# EAGLE design SolarCharger_Rev1 (EAGLE 7.4.0)
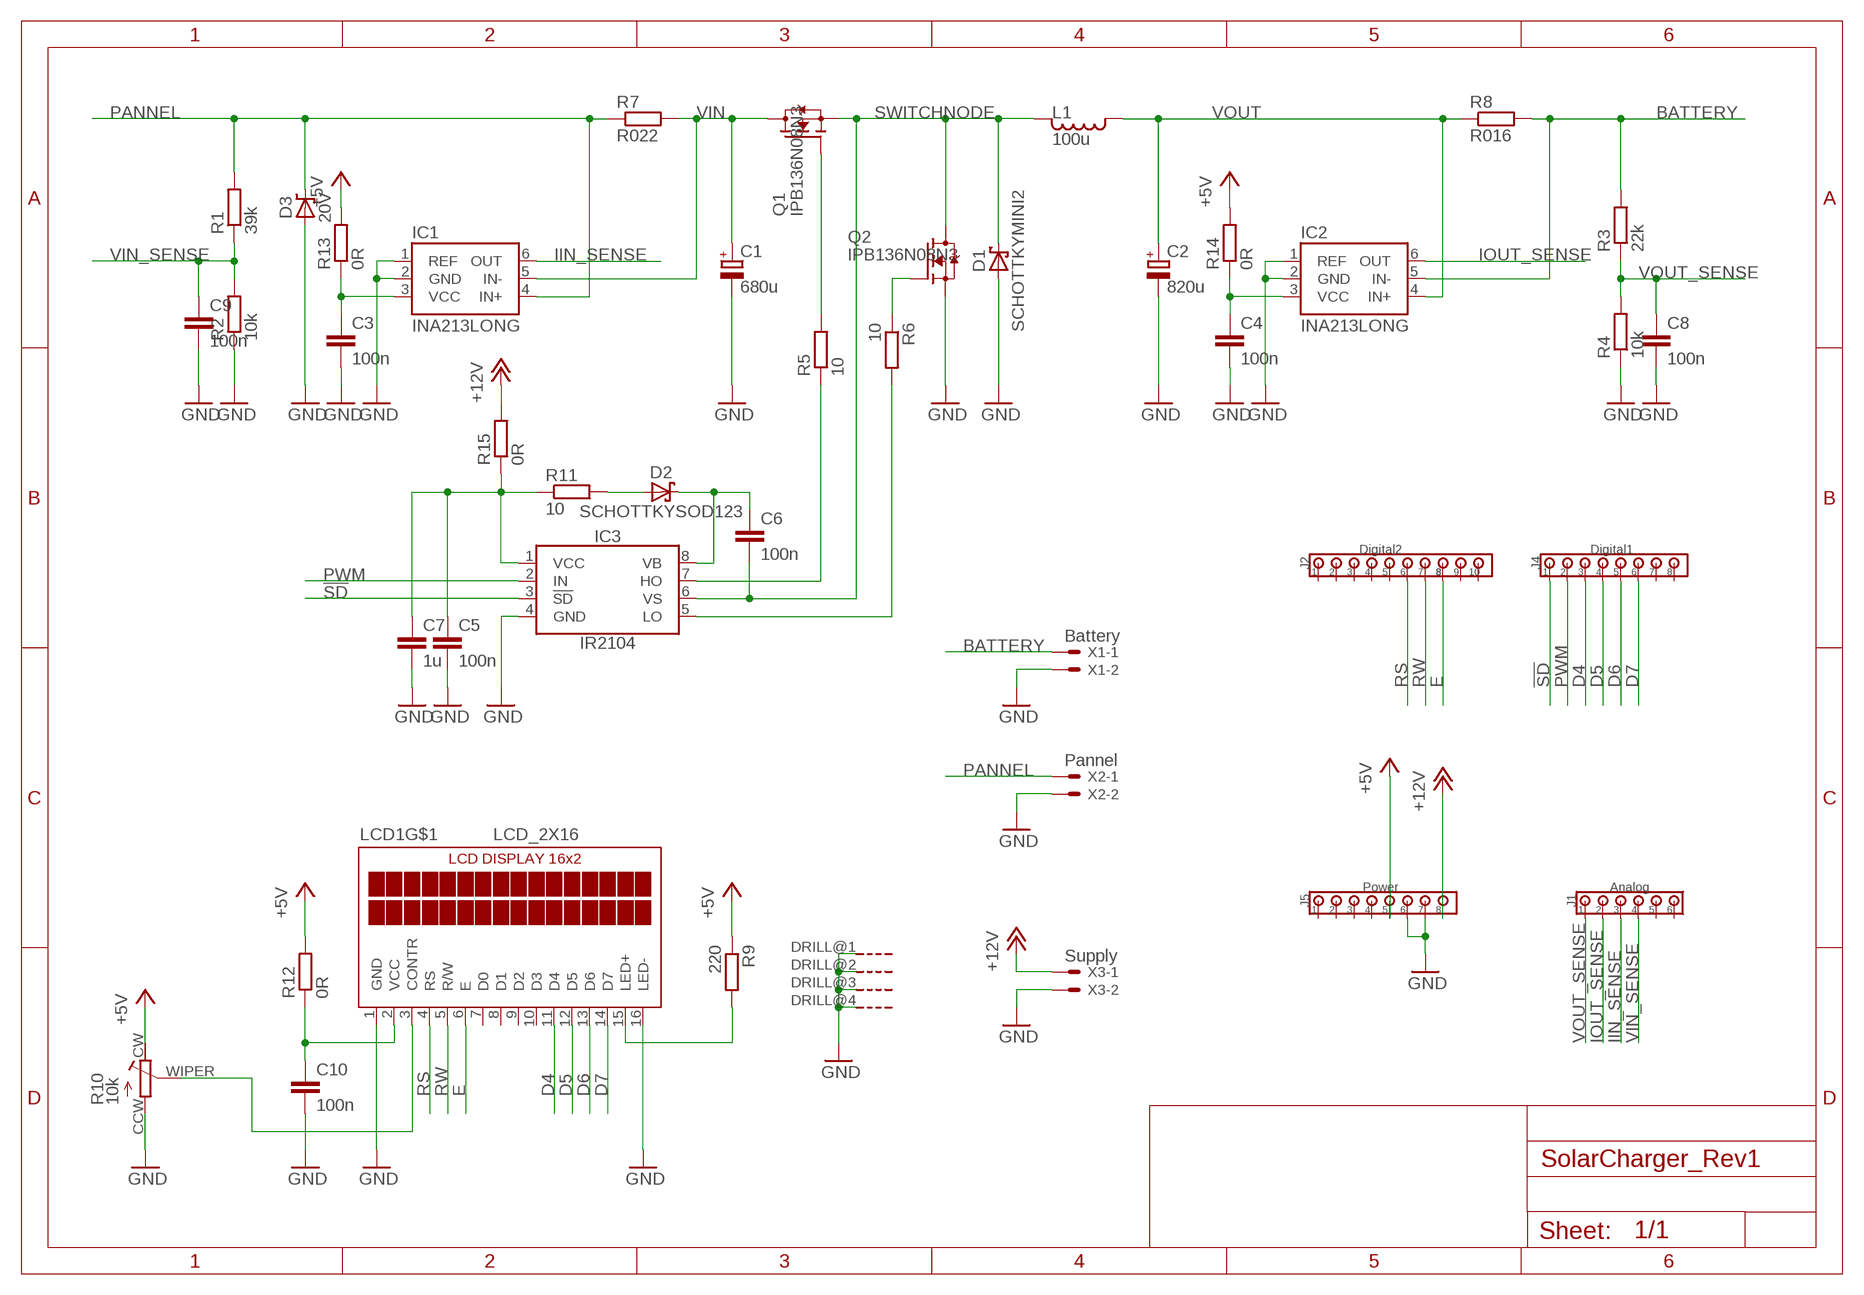
[diagram p0: schematic, sheet 1]

## Parts
C1  680u  C_POLARIZED10MM  [10MM]
C2  820u  C_POLARIZED10MM  [10MM]
C3  100n  CC0805  [C0805]
C4  100n  CC0805  [C0805]
C5  100n  CC0805  [C0805]
C6  100n  CC0805  [C0805]
C7  1u  CC0805  [C0805]
C8  100n  CC0805  [C0805]
C9  100n  CC0805  [C0805]
C10  100n  CC0805  [C0805]
D1  SCHOTTKYMINI2  [MINI2-F3-B]
D2  SCHOTTKYSOD123  [SOD123]
D3  20V  ZENERSMC  [SMC]
IC1  INA213LONG  [SC70-6_LONG]
IC2  INA213LONG  [SC70-6_LONG]
IC3  IR2104  [SOIC8]
J1  Analog  100MIL_6X  [100MIL_6X_ROUND]
J2  Digital2  100MIL_10X  [100MIL_10X_ROUND]
J4  Digital1  100MIL_8X  [100MIL_8X_ROUND]
J5  Power  100MIL_8X  [100MIL_8X_ROUND]
L1  100u  INDUCTORMSS1583  [MSS1583]
LCD1  LCD_2X16  [LCD_2X16]
Q1  IPB136N08N3  N-PWR-MOSFETTO263-3  [TO263-3]
Q2  IPB136N08N3  IPB136N08N3_GTO263  [TO263-3@1]
R1  39k  RESISTORR0805  [R0805]
R2  10k  RESISTORR0805  [R0805]
R3  22k  RESISTORR0805  [R0805]
R4  10k  RESISTORR0805  [R0805]
R5  10  RESISTORR0805  [R0805]
R6  10  RESISTORR0805  [R0805]
R7  R022  RESISTOR0612  [0612]
R8  R016  RESISTOR0612  [0612]
R9  220  RESISTORR0805  [R0805]
R10  10k  TRIMMER3314G  [RTRIM3314G]
R11  10  RESISTORR0805  [R0805]
R12  0R  RESISTORR0805  [R0805]
R13  0R  RESISTORR0805  [R0805]
R14  0R  RESISTORR0805  [R0805]
R15  0R  RESISTORR0805  [R0805]
X1  Battery  22-23-2021200MIL  [200MIL_2X]
X2  Pannel  22-23-2021200MIL  [200MIL_2X]
X3  Supply  22-23-2021100MIL  [22-23-2021]

## Nets
!SD!: IC3.3(!SD!) J4.1
+5V: J5.5 R9.1 R10.CW R12.2 R13.2 R14.2
+12V: J5.8 R15.2 X3.1
BATTERY: IC2.5(IN-) R3.2 R8.2 X1.1
D4: J4.3 LCD1.11(D4)
D5: J4.4 LCD1.12(D5)
D6: J4.5 LCD1.13(D6)
D7: J4.6 LCD1.14(D7)
E: J2.8 LCD1.6(E)
GND: C1.- C2.- C3.2 C4.2 C5.2 C7.2 C8.2 C9.2 C10.2 D1.A D3.A IC1.1(REF) IC1.2(GND) IC2.1(REF) IC2.2(GND) IC3.4(GND) J5.6 J5.7 LCD1.1(GND) LCD1.16(LED-) LCD1.DRILL@1(G) LCD1.DRILL@2(G) LCD1.DRILL@3(G) LCD1.DRILL@4(G) Q2.3(S) R2.1 R4.1 R10.CCW X1.2 X2.2 X3.2
IIN_SENSE: IC1.6(OUT) J1.3
IOUT_SENSE: IC2.6(OUT) J1.2
N$1: C10.1 LCD1.2(VCC) R12.1
N$2: C3.1 IC1.3(VCC) R13.1
N$3: C4.1 IC2.3(VCC) R14.1
N$4: Q1.1(G) R5.2
N$5: C5.1 C7.1 IC3.1(VCC) R11.1 R15.1
N$7: Q2.1(G) R6.1
N$9: LCD1.15(LED+) R9.2
N$10: LCD1.3(CONTR) R10.WIPER
N$11: D2.A R11.2
N$12: C6.1 D2.C IC3.8(VB)
N$14: IC3.7(HO) R5.1
N$15: IC3.5(LO) R6.2
PANNEL: D3.C IC1.4(IN+) R1.2 R7.1 X2.1
PWM: IC3.2(IN) J4.2
RS: J2.6 LCD1.4(RS)
RW: J2.7 LCD1.5(R/W)
SWITCHNODE: C6.2 D1.C IC3.6(VS) L1.2 Q1.3(S) Q2.TAB(D)
VIN: C1.+ IC1.5(IN-) Q1.TAB(D) R7.2
VIN_SENSE: C9.1 J1.4 R1.1 R2.2
VOUT: C2.+ IC2.4(IN+) L1.1 R8.1
VOUT_SENSE: C8.1 J1.1 R3.1 R4.2
Unconnected: J1.5 J1.6 J2.1 J2.2 J2.3 J2.4 J2.5 J2.9 J2.10 J4.7 J4.8 J5.1 J5.2 J5.3 J5.4 LCD1.7(D0) LCD1.8(D1) LCD1.9(D2) LCD1.10(D3)

## Library data of the parts
C1 C2 = 00Capacitor:C_POLARIZED
C3-C10 = 00Capacitor:C: Capacitor
D1 D2 = 00Diode:SCHOTTKY
D3 = 00Diode:ZENER
IC1 IC2 = 00Sensor:INA21*: Current-Shunt Monitors Voltage Output, Low- or High-Side Measurement, Bidirectional, Zero-Drift Series; GAIN: 50
IC3 = 00Logic:IR2104: Half-Bridge Driver Up to +600V Gate drive supply 10-20V Deadtime 520ns
J1 = 00Connector:100MIL_6X: 100 mil 6-pin connector
J2 = 00Connector:100MIL_10X: 100mil 10-pin connector
J4 J5 = 00Connector:100MIL_8X: 100 mil 8-pin connector
L1 = 00Inductor:INDUCTOR
LCD1 = 00Display:LCD_2X16
Q1 = 00Mosfet:N-PWR-MOSFET
Q2 = 00Mosfet:IPB136N08N3_G
R1-R9 R11-R15 = 00Resistor:RESISTOR: RESISTOR, European symbol
R10 = 00Resistor:TRIMMER
X1 X2 = 00Connector:22-23-2021: .100" (2.54mm) Center Header - 2 Pin
X3 = 00Connector:22-23-2021: .100" (2.54mm) Center Header - 2 Pin; MF: MOLEX; MPN: 22-23-2021; OC_FARNELL: 1462926; OC_NEWARK: 25C3832

## Board
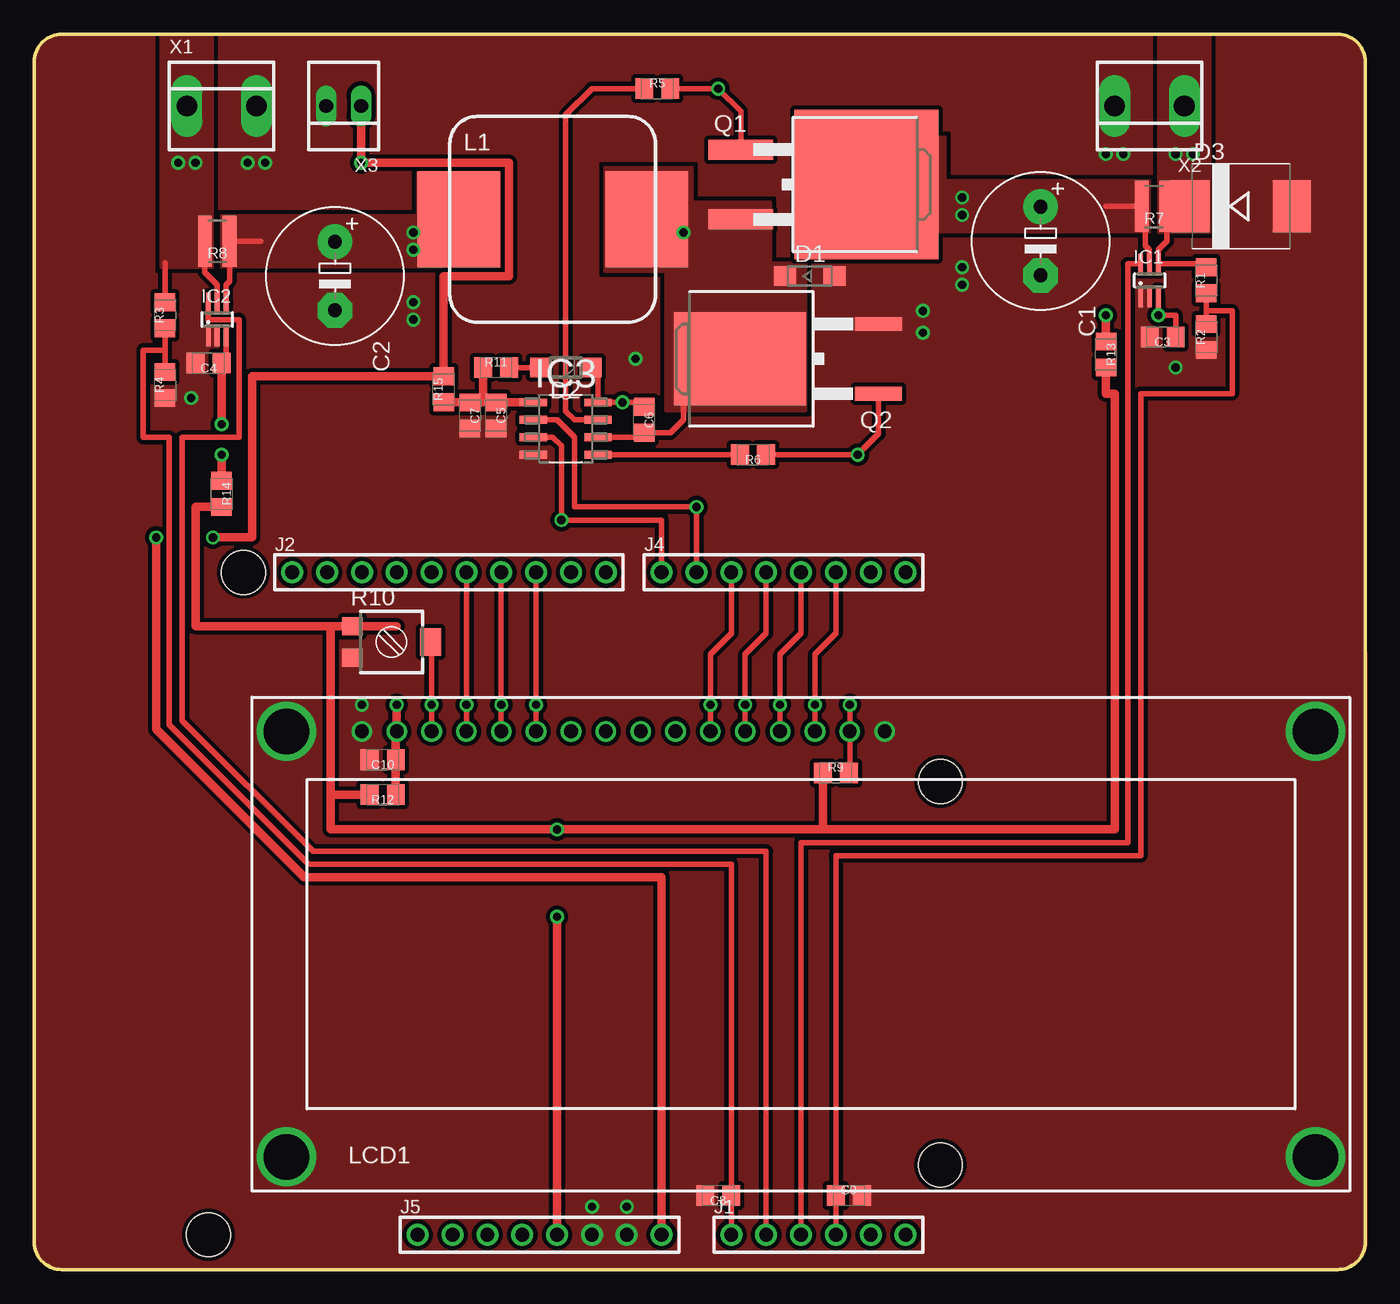
[diagram p1: board, top side]
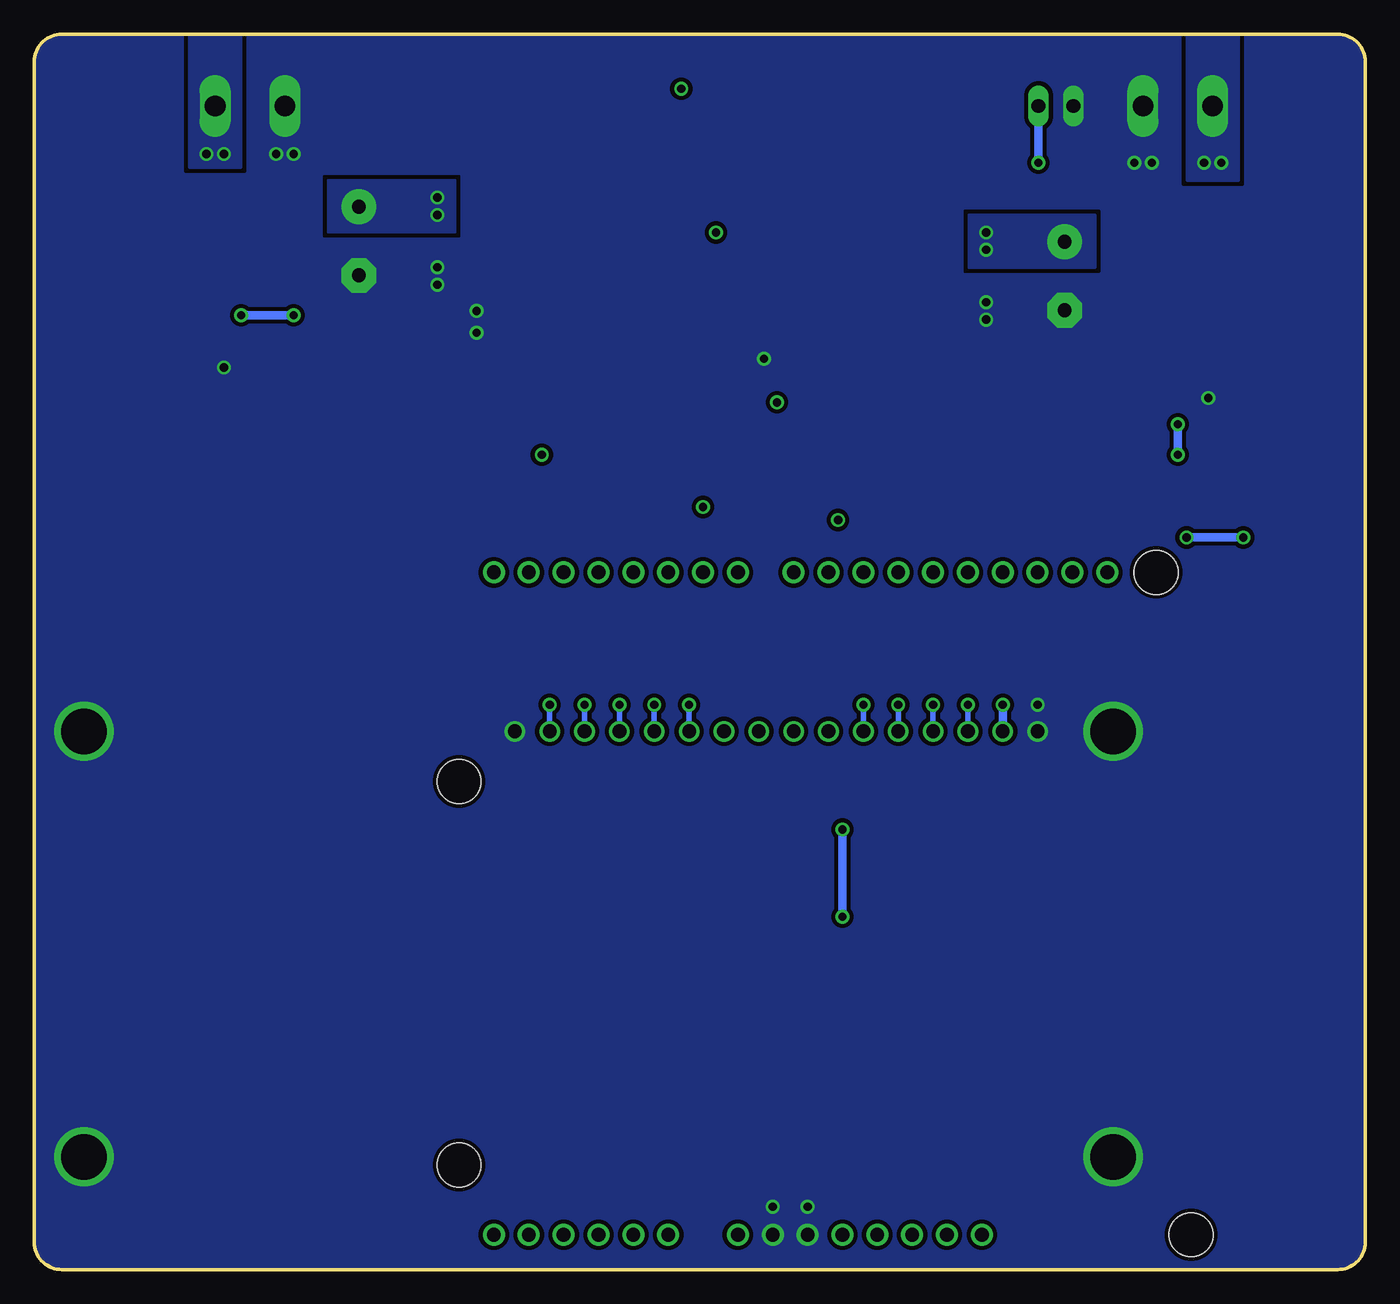
[diagram p2: board, bottom side, seen from below]

Size 97 x 90 mm. Coordinates in mm from the lower left corner, seen from the top.
Outline: 65.04,0 95,0 arc90 97,2 97,88 arc90 95,90 2,90 arc90 0,88 0,2 arc90 2,0 65.02,0
Outline: 65.02,0 arc-90 65.04,0
Outline: 65.04,0 65.02,0
Copper layers (1*16): Top 0.035mm / dielectric 1.5mm / Bottom 0.035mm
Design rules "default *": minimum track width 10mil, minimum drill 24mil, track to track 8mil, track to pad 8mil, pad to pad 8mil, via to via 8mil, smd to smd 8mil, copper to edge 0mil, drill to drill 8mil, minimum pad ring 10mil, minimum via ring 8mil, stop-mask expansion 4mil, vias tented up to drill 0mil, thermal gap 10mil
Holes 3.2 mm at 15.24,50.8 66.04,7.62 66.04,35.56 12.7,2.54

### Footprints (pad centres in the part's own frame; a part is rotated, then mirrored left to right if it is on the bottom)
10MM = drill 1.016 pad 2.54: + -2.5,0 | drill 1.016 pad 2.54 octagon: - 2.5,0
C0805 = smd 1.3 x 1.5: 1 -0.95,0; 2 0.95,0
MINI2-F3-B = smd 1.6 x 1.4: A 1.8,0; C -1.8,0
SOD123 = smd 1.4 x 1.4: A 1.9,0; C -1.9,0
SMC = smd 2.8 x 3.8: A 3.7,0; C -3.7,0
SC70-6_LONG = smd 0.35 x 1.5: 1 -0.65,-1.2; 2 0,-1.2; 3 0.65,-1.2; 4 0.65,1.2; 5 0,1.2; 6 -0.65,1.2
SOIC8 = smd 1.981 x 0.559: 1 -2.362,1.905; 2 -2.362,0.635; 3 -2.362,-0.635; 4 -2.362,-1.905; 5 2.362,-1.905; 6 2.362,-0.635; 7 2.362,0.635; 8 2.362,1.905
100MIL_6X_ROUND = drill 1 pad 1.6: 1 -6.35,0; 2 -3.81,0; 3 -1.27,0; 4 1.27,0; 5 3.81,0; 6 6.35,0
100MIL_10X_ROUND = drill 1 pad 1.6: 1 -8.89,0; 2 -6.35,0; 3 -3.81,0; 4 -1.27,0; 5 1.27,0; 6 3.81,0; 7 6.35,0; 8 8.89,0; 9 11.43,0; 10 13.97,0
100MIL_8X_ROUND = drill 1 pad 1.6: 1 -8.89,0; 2 -6.35,0; 3 -3.81,0; 4 -1.27,0; 5 1.27,0; 6 3.81,0; 7 6.35,0; 8 8.89,0
MSS1583 = smd 6 x 7: 1 -6.85,0; 2 6.85,0
LCD_2X16 = drill 1: 1 8,33.5; 2 10.54,33.5; 3 13.08,33.5; 4 15.62,33.5; 5 18.16,33.5; 6 20.7,33.5; 7 23.24,33.5; 8 25.78,33.5; 9 28.32,33.5; 10 30.86,33.5; 11 33.4,33.5; 12 35.94,33.5; 13 38.48,33.5; 14 41.02,33.5; 15 43.56,33.5; 16 46.1,33.5 | drill 3.3: DRILL@1 2.5,33.5; DRILL@2 77.5,33.5; DRILL@3 77.5,2.5; DRILL@4 2.5,2.5
TO263-3 = smd 1.45 x 4.7: 1 -2.54,-5.65; 3 2.54,-5.65 | smd 10.9 x 10.5: TAB 0,3.5
TO263-3@1 = smd 1 x 3.4: 1 -2.54,-6.6; 3 2.54,-6.6 | smd 6.8 x 9.6: TAB 0,3.5
R0805 = smd 1.3 x 1.5: 1 -0.95,0; 2 0.95,0
0612 = smd 1 x 3.7: 1 -0.9,0; 2 0.9,0
RTRIM3314G = smd 1.3 x 1.5: CCW 1.15,-2.85; CW -1.15,-2.85 | smd 2 x 1.5: WIPER 0,2.85
200MIL_2X = drill 1.5 long: 1 -2.54,0; 2 2.54,0
22-23-2021 = drill 1 long: 1 -1.27,0; 2 1.27,0

### Placement (x,y rotation side)
C1  73.34,74.93 270 top
C2  21.91,72.39 270 top
C3  82.23,67.94 180 top
C4  12.7,66.04 180 top
C5  33.66,62.23 270 top
C6  44.45,61.91 270 top
C7  31.75,62.23 270 top
C8  49.85,5.4 180 top
C9  59.37,5.4 0 top
C10  25.4,37.15 180 top
D1  56.52,72.39 0 top
D2  38.73,65.72 180 top
D3  87.95,77.47 0 top
IC1  81.28,72.07 0 top
IC2  13.34,69.22 0 top
IC3  38.73,61.28 0 top
J1  57.15,2.54 0 top
J2  27.69,50.8 0 top
J4  54.61,50.8 0 top
J5  36.83,2.54 0 top
L1  37.78,76.52 0 top
LCD1  15.88,5.71 0 top
Q1  57.15,79.06 270 top
Q2  54.93,66.36 90 top
R1  85.41,72.07 90 top
R2  85.41,67.94 90 top
R3  9.53,69.53 90 top
R4  9.53,64.45 90 top
R5  45.4,86.04 0 top
R6  52.39,59.37 180 top
R7  81.6,77.47 180 top
R8  13.34,74.93 180 top
R9  58.42,36.2 0 top
R10  26.04,45.72 270 top
R11  33.66,65.72 0 top
R12  25.4,34.61 180 top
R13  78.11,66.67 270 top
R14  13.65,56.52 270 top
R15  29.84,64.14 90 top
X1  13.65,84.77 0 top
X2  81.28,84.77 180 top
X3  22.54,84.77 180 top

### Tracks (layer width: path | path; a pad name or v marks a point on that pad's centre or on a via)
!SD!  (via drill 0.6)
  Top 0.406: IC3.3 37.78,60.64 38.42,60.01 v38.42,54.61 45.72,54.61 J4.1
+5V  (via drill 0.6)
  Top 0.61: 26.41,46.87 R10.CW 21.59,46.87 | J5.5 v38.1,25.72 | 21.59,46.87 11.75,46.87 11.75,55.56 12.38,55.56 R14.2 | 57.47,32.07 78.74,32.07 78.74,63.82 78.11,63.82 R13.2 | 57.47,32.07 v38.1,32.07 21.59,32.07 21.59,34.61 | R9.1 57.47,32.07 | 21.59,34.61 21.59,46.87 | R12.2 21.59,34.61
  Bottom 0.61: v38.1,25.72 v38.1,32.07
+12V  (via drill 0.6)
  Top 0.61: X3.1 v23.81,80.64 34.61,80.64 34.61,72.39 29.84,72.39 R15.2 15.88,65.08 15.88,53.34 v13.02,53.34 | v8.89,53.34 8.89,39.37 19.68,28.57 45.72,28.57 J5.8
  Bottom 0.61: v13.02,53.34 v8.89,53.34 | v23.81,80.64 X3.1
BATTERY  (via drill 0.6)
  Top 0.406: IC2.5 13.34,71.75 12.44,72.66 R8.2 | R3.2 9.53,73.34
  other vias: 10.48,80.64 11.75,80.64
  pour Top (isolate 0.305, no thermals): 13.02,73.03 13.02,89.85 9.21,89.85 9.21,73.03
  pour Bottom (isolate 0.305, no thermals): 9.21,89.85 13.02,89.85 13.02,79.38 9.21,79.38
D4  (via drill 0.6)
  Top 0.406: J4.3 50.8,46.35 49.27,44.83 LCD1.11
  Bottom 0.406: v49.28,41.15 49.28,39.12 49.27,39.12 LCD1.11
D5  (via drill 0.6)
  Top 0.406: J4.4 53.34,46.35 51.81,44.83 LCD1.12
  Bottom 0.406: v51.82,41.15 51.82,39.12 51.81,39.12 LCD1.12
D6  (via drill 0.6)
  Top 0.406: J4.5 55.88,46.35 54.35,44.83 LCD1.13
  Bottom 0.406: v54.36,41.15 54.36,39.37 | 54.36,39.37 54.36,39.12 | LCD1.13 54.35,39.37 54.36,39.37
D7  (via drill 0.6)
  Top 0.406: J4.6 58.42,46.35 56.9,44.83 LCD1.14
  Bottom 0.406: v56.9,41.15 56.9,39.12 LCD1.14
E  (via drill 0.6)
  Top 0.406: LCD1.6 J2.8
  Bottom 0.406: v36.58,41.15 36.58,39.12 LCD1.6
GND  (via drill 0.6)
  other vias: 40.64,4.57 43.18,4.57 43.81,66.36 67.63,73.03 67.63,71.75 27.62,70.48 27.62,69.22 15.56,80.64 16.83,80.64 78.11,81.28 79.38,81.28 83.19,65.72 11.43,63.5 64.77,69.85 64.77,68.26 23.88,41.15
  pour Top (isolate 0.305, rank 2, no thermals): 2,90 95,90 arc-90 97,88 97.04,2 arc-91 95,0 2,0 arc-90 0,2 0,88 arc-90
  pour Bottom (isolate 0.305, rank 2, no thermals): 0,88 arc-90 2,90 95,90 arc-90 97,88 97,2 arc-90 95,0 2,0 arc-90 0,2
IIN_SENSE
  Top 0.406: IC1.6 79.69,73.27 79.69,31.11 55.88,31.11 J1.3
IOUT_SENSE
  Top 0.406: IC2.6 12.69,69.22 14.92,69.22 14.92,60.64 10.79,60.64 10.79,40.01 20.32,30.48 53.34,30.48 J1.2
N$1  (via drill 0.6)
  Top 0.61: LCD1.2 26.35,39.22 C10.1 R12.1 | v26.42,41.15 26.42,39.12
  Bottom 0.61: v26.42,41.15 arc90 v26.41,41.15 LCD1.2
N$2  (via drill 0.6)
  Top 0.406: IC1.3 v81.93,69.53 | v81.93,69.53 83.19,69.53 C3.1 | v81.93,69.53 v81.92,69.53
  Top 0.61: R13.1 v78.11,69.53
  Bottom 0.61: v81.92,69.53 v78.11,69.53
N$3  (via drill 0.6)
  Top 0.406: IC2.3 13.98,66.38 C4.1
  Top 0.61: R14.1 13.65,59.05 v13.65,59.37 | C4.1 v13.65,61.6 v13.65,61.59
  Bottom 0.61: v13.65,61.59 v13.65,59.37
N$4  (via drill 0.6)
  Top 0.406: Q1.1 51.5,84.39 v49.85,86.04 R5.2
N$5
  Top 0.61: R15.1 C7.1 32.7,63.18 | 32.7,63.18 C5.1 IC3.1 | R11.1 32.7,63.18
N$7  (via drill 0.6)
  Top 0.406: R6.1 v60.01,59.37 61.53,60.89 Q2.1
N$9  (via drill 0.6)
  Top 0.406: LCD1.15 | LCD1.15 v59.44,41.15 | LCD1.15 59.44,36.26 R9.2
  Bottom 0.406: LCD1.15 v59.44,41.15
N$10  (via drill 0.6)
  Top 0.406: LCD1.3 28.95,45.65 R10.WIPER
  Bottom 0.406: v28.96,41.15 28.96,39.12 28.95,39.12 LCD1.3
N$11
  Top 0.406: R11.2 D2.A
N$12  (via drill 0.6)
  Top 0.406: C6.1 44.13,63.18 v42.86,63.18 IC3.8 41.1,65.26 D2.C
N$14
  Top 0.406: IC3.7 39.37,61.91 38.73,62.55 38.73,84.14 40.64,86.04 R5.1
N$15
  Top 0.406: IC3.5 R6.2
PANNEL  (via drill 0.6)
  Top 0.406: D3.C R7.1 82.55,77.42 82.55,74.93 81.93,74.31 IC1.4 85.41,73.27 R1.2
  other vias: 83.19,81.28 84.45,81.28
  pour Top (isolate 0.305, no thermals): 85.72,75.56 85.72,89.85 81.92,89.85 81.92,75.56
  pour Bottom (isolate 0.305, no thermals): 85.72,89.85 85.72,80.33 81.92,80.33 81.92,89.85
PWM  (via drill 0.6)
  Top 0.406: IC3.2 38.1,61.91 39.37,60.64 39.37,55.56 v48.26,55.56 J4.2
RS  (via drill 0.6)
  Top 0.406: LCD1.4 J2.6
  Bottom 0.406: v31.5,41.15 31.5,39.12 LCD1.4
RW  (via drill 0.6)
  Top 0.406: LCD1.5 J2.7
  Bottom 0.406: v34.04,41.15 LCD1.5 | 34.04,39.12 LCD1.5 | LCD1.5
SWITCHNODE  (via drill 0.6)
  Top 0.406: IC3.6 44.13,60.64 C6.2 46.36,60.96 47.31,61.91 47.31,66.36 Q2.TAB
  other vias: 47.31,75.56
  pour Top (isolate 0.305, no thermals): 41.59,80.33 47.94,80.33 47.94,77.79 53.66,77.79 53.66,73.34 56.2,73.34 56.2,62.55 46.04,62.55 46.04,72.71 41.59,72.71
VIN  (via drill 0.6)
  Top 0.406: 78.11,77.47 R7.2 80.96,77.2 80.96,74.61 81.28,74.3 IC1.5
  other vias: 67.63,78.11 67.63,76.83
  pour Top (isolate 0.305, no thermals): 81.28,79.38 81.28,75.56 56.83,75.56 56.83,82.55 66.36,82.55 66.36,79.38
  pour Bottom (isolate 0.305, no thermals): 75.56,75.56 75.56,79.38 66.36,79.38 66.36,75.56
VIN_SENSE
  Top 0.406: R1.1 85.41,69.85 | 85.41,69.85 87.31,69.85 87.31,63.82 80.64,63.82 80.64,30.16 58.42,30.16 C9.1 | R2.2 85.41,69.85 | C9.1 J1.4 | C9.1
VOUT  (via drill 0.6)
  Top 0.406: IC2.4 13.98,71.74 13.97,71.75 14.23,72.02 R8.1 16.5,74.93
  other vias: 27.62,75.56 27.62,74.3
  pour Top (isolate 0.305, no thermals): 33.97,80.01 33.97,73.03 13.65,73.03 13.65,76.83 27.94,76.83 27.94,80.01
  pour Bottom (isolate 0.305, no thermals): 19.68,73.03 19.68,76.83 28.89,76.83 28.89,73.03
VOUT_SENSE
  Top 0.406: R4.2 9.53,66.99 | 9.53,66.99 R3.1 | 9.53,66.99 7.94,66.99 7.94,60.64 9.84,60.64 9.84,39.69 20,29.53 50.8,29.53 C8.1 J1.1

### Text on the board
tText: Bat | 12V | Pan | MPPT Solar Charger | Lukas Fässler | 2015 Rev A